# EAGLE design 3UP.v1 (EAGLE 7.3.0)
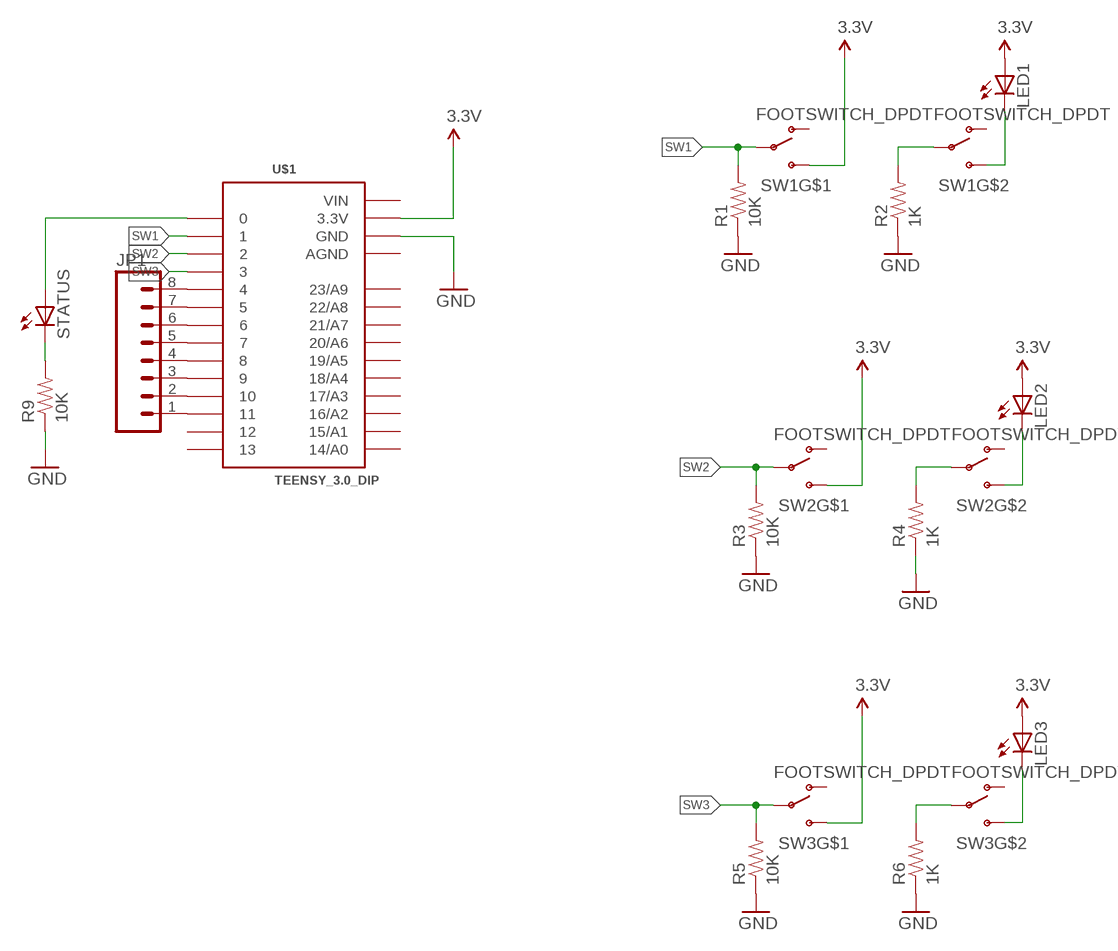
[diagram p0: schematic, sheet 1]

## Parts
JP1  M08NO_SILK  [1X08_NO_SILK]
LED1  LED5MM-W/STENCIL  [LED5MM-STENCILHOLE]
LED2  LED5MM-W/STENCIL  [LED5MM-STENCILHOLE]
LED3  LED5MM-W/STENCIL  [LED5MM-STENCILHOLE]
R1  10K  RESISTOR0805-RES  [0805]
R2  1K  RESISTOR0805-RES  [0805]
R3  10K  RESISTOR0805-RES  [0805]
R4  1K  RESISTOR0805-RES  [0805]
R5  10K  RESISTOR0805-RES  [0805]
R6  1K  RESISTOR0805-RES  [0805]
R9  10K  RESISTOR0805-RES  [0805]
STATUS  LED5MM-W/STENCIL  [LED5MM-STENCILHOLE]
SW1  FOOTSWITCH_DPDT  [FOOTSWITCH]
SW2  FOOTSWITCH_DPDT  [FOOTSWITCH]
SW3  FOOTSWITCH_DPDT  [FOOTSWITCH]
U$1  TEENSY_3.0_DIP  [TEENSY_3.0_DIP]

## Nets
3.3V: LED1.A LED2.A LED3.A SW1.P$3(S) SW2.P$3(S) SW3.P$3(S) U$1.3.3V
GND: R1.1 R2.1 R3.1 R4.1 R5.1 R6.1 R9.1 U$1.GND
N$1: R4.2 SW2.P$5(P)
N$2: R2.2 SW1.P$5(P)
N$3: LED1.K(C) SW1.P$6(S)
N$4: LED2.K(C) SW2.P$6(S)
N$5: R6.2 SW3.P$5(P)
N$6: LED3.K(C) SW3.P$6(S)
N$9: R9.2 STATUS.K(C)
N$10: STATUS.A U$1.0
N$13: JP1.1 U$1.11
N$14: JP1.2 U$1.10
N$15: JP1.3 U$1.9
N$16: JP1.4 U$1.8
N$17: JP1.5 U$1.7
N$18: JP1.6 U$1.6
N$19: JP1.7 U$1.5
N$20: JP1.8 U$1.4
SW1: R1.2 SW1.P$2(P) U$1.1
SW2: R3.2 SW2.P$2(P) U$1.2
SW3: R5.2 SW3.P$2(P) U$1.3
Unconnected: SW1.P$1(O) SW1.P$4(O) SW2.P$1(O) SW2.P$4(O) SW3.P$1(O) SW3.P$4(O) U$1.12 U$1.13 U$1.14/A0 U$1.15/A1 U$1.16/A2 U$1.17/A3 U$1.18/A4 U$1.19/A5 U$1.20/A6 U$1.21/A7 U$1.22/A8 U$1.23/A9

## Power pins joined to a net without a drawn wire
AGND: U$1.AGND
VIN: U$1.VIN

## Library data of the parts
JP1 = SparkFun-Connectors:M08: Header 8 Standard 8-pin 0.1" header. Use with straight break away headers (SKU : PRT-00116), right angle break away headers (PRT-00553), swiss pins (PRT-00743), machine pins (PRT-00117), and female headers (PRT-00115).
LED1-LED3 STATUS = SparkFun-LED:LED: LEDs Standard schematic elements and footprints for 5mm, 3mm, 1206, and 0603 sized LEDs. 5mm - Spark Fun Electronics SKU : COM-00529 (and others)
R1-R6 R9 = SparkFun-Passives:RESISTOR: Resistor Basic schematic elements and footprints for 0603, 1206, and PTH resistors.
SW1-SW3 = barsstronics:FOOTSWITCH_DPDT
U$1 = Teensy3.0:TEENSY_3.0_DIP

## Board
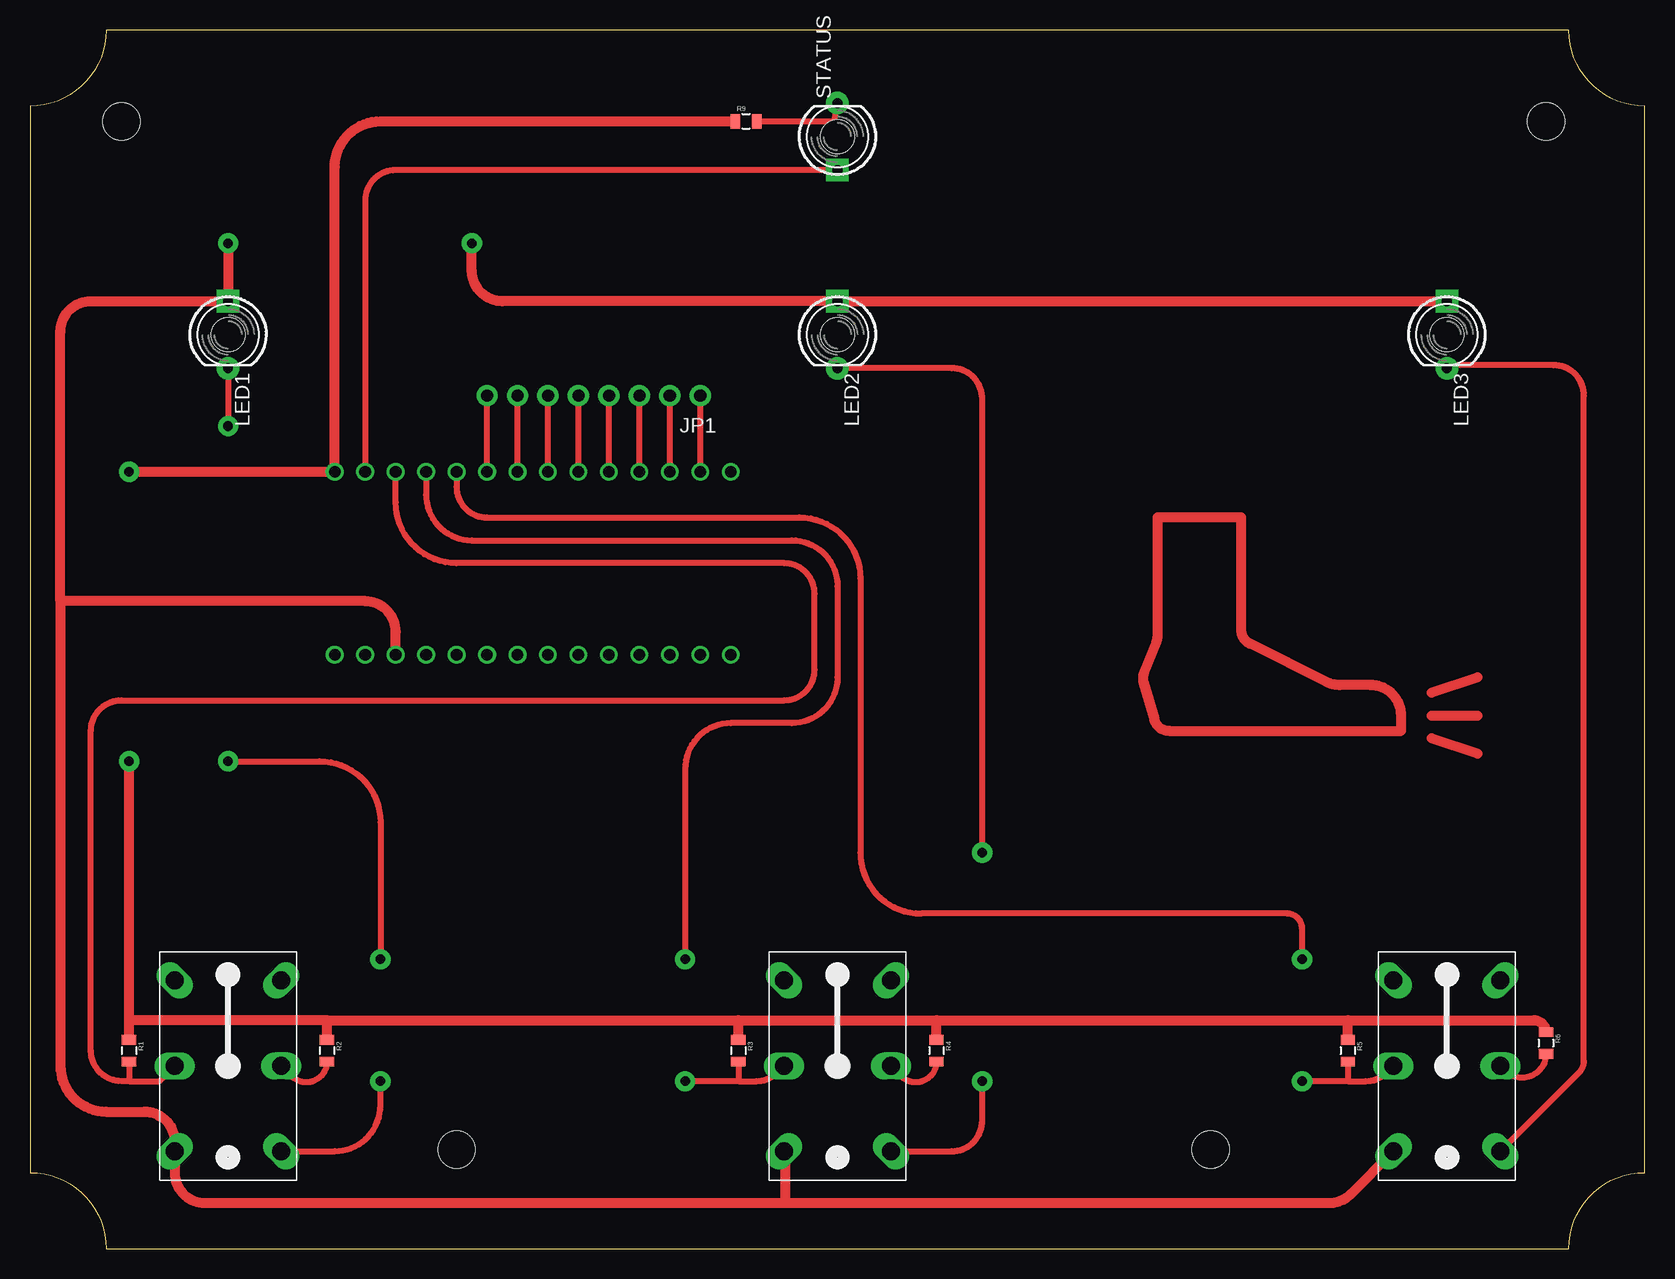
[diagram p1: board, top side]
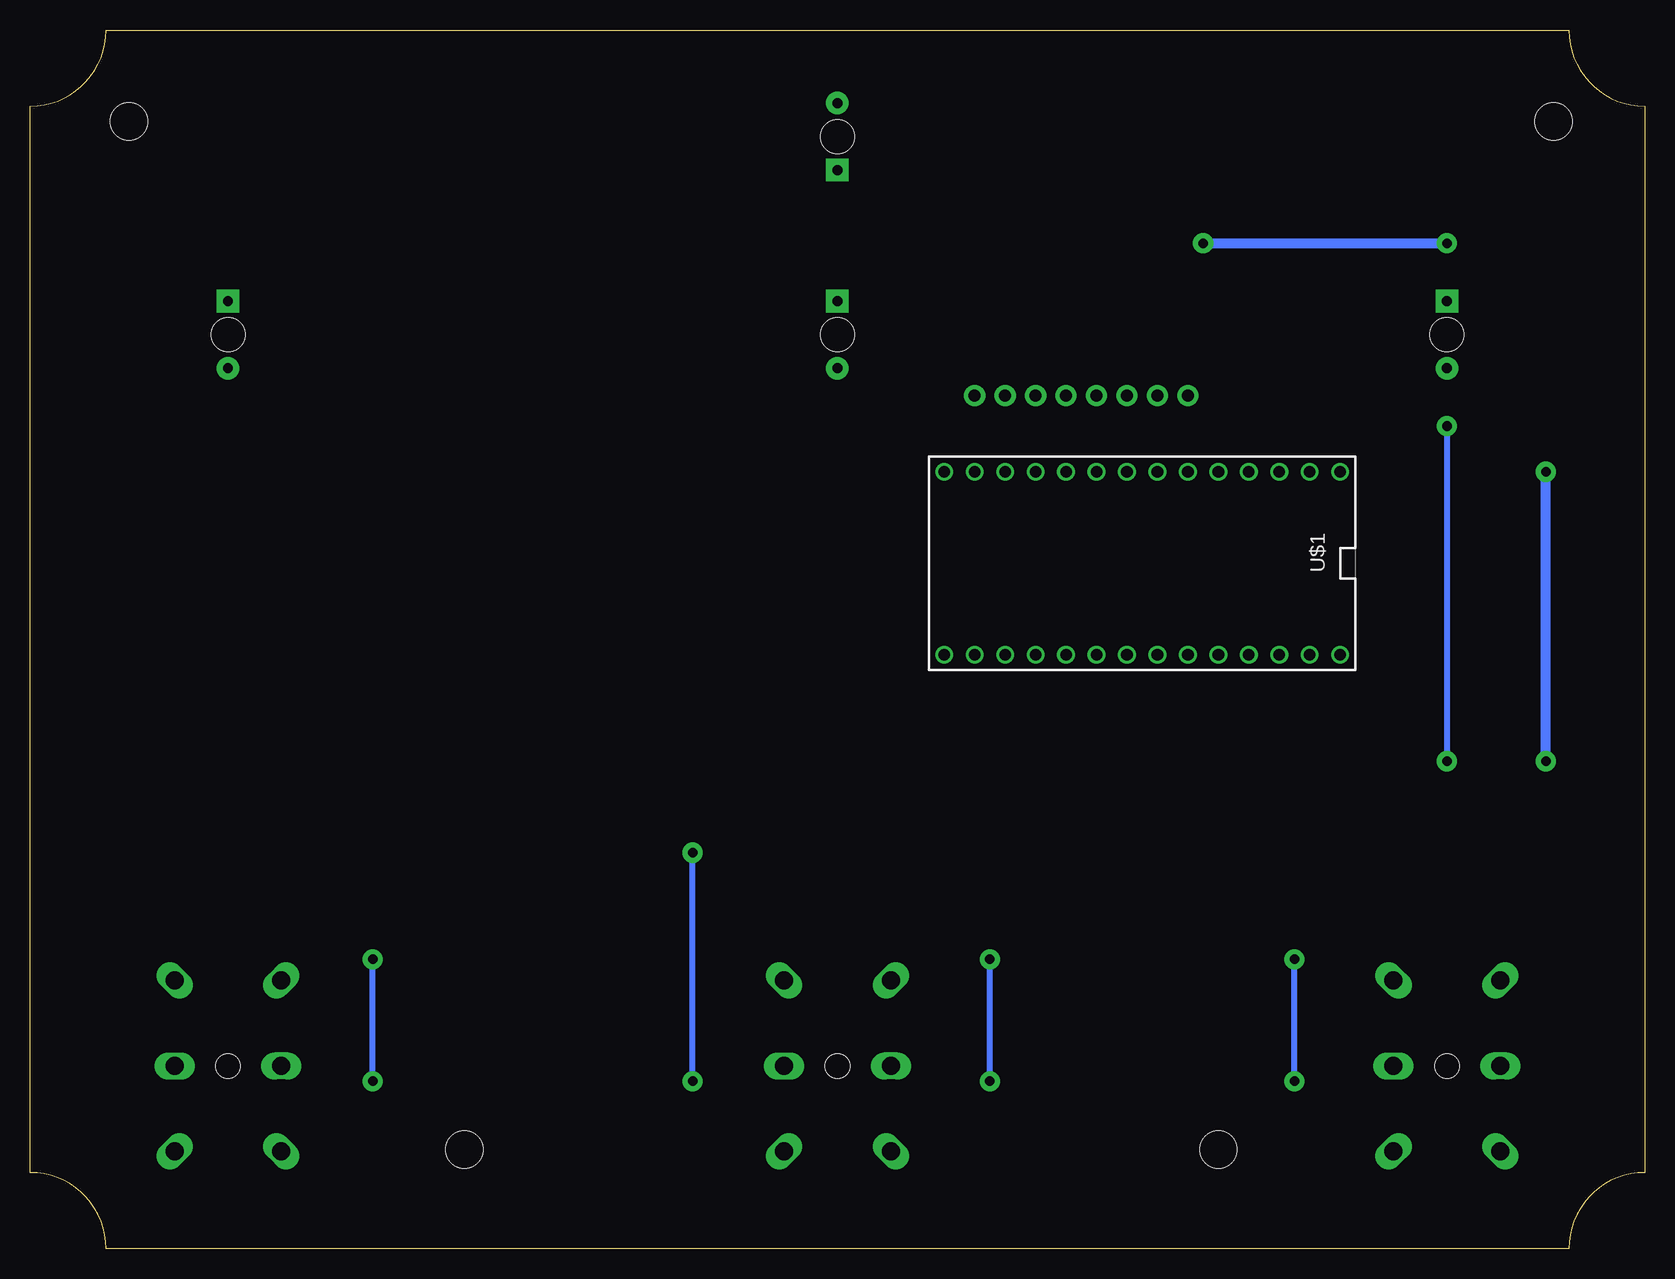
[diagram p2: board, bottom side, seen from below]

Size 134.62 x 101.6 mm. Coordinates in mm from the lower left corner, seen from the top.
Outline: 6.35,0 128.27,0 arc-90 134.62,6.35 134.62,95.25 arc-90 128.27,101.6 6.35,101.6 arc-90 0,95.25 0,6.35 arc-90 6.35,0
Copper layers (1*16): Top 0.035mm / dielectric 1.5mm / Bottom 0.035mm
Design rules "Othermill-DRC-1-32": minimum track width 8mil, minimum drill 0.8mm, track to track 0.794003125mm, track to pad 0.794003125mm, pad to pad 0.794003125mm, via to via 0.794003125mm, smd to smd 0mil, copper to edge 0mil, drill to drill 1mil, minimum pad ring 10mil, minimum via ring 10mil, stop-mask expansion 1mil, vias tented up to drill 30mil, thermal gap 10mil
Holes 2.03 mm at 16.51,15.24 67.31,15.24 118.11,15.24
Holes 3.1 mm at 126.36,93.98 7.62,93.98 98.42,8.26 35.56,8.26

### Footprints (pad centres in the part's own frame; a part is rotated, then mirrored left to right if it is on the bottom)
1X08_NO_SILK = drill 1.016 pad 1.778: 1 0,0; 2 2.54,0; 3 5.08,0; 4 7.62,0; 5 10.16,0; 6 12.7,0; 7 15.24,0; 8 17.78,0
LED5MM-STENCILHOLE = drill 0.813 pad 1.88 square: A -2.794,0 | drill 0.813 pad 1.88: K 2.794,0 | hole 2.8: 0,0
0805 = smd 0.8 x 1.2: 1 -0.9,0; 2 0.9,0
FOOTSWITCH = drill 1.5 long: P$1 -4.445,7.112; P$2 -4.445,0; P$3 -4.445,-7.112; P$4 4.445,7.112; P$5 4.445,0; P$6 4.445,-7.112
TEENSY_3.0_DIP = drill 0.965: 0 -7.62,13.97; 1 -7.62,11.43; 2 -7.62,8.89; 3 -7.62,6.35; 3.3V 7.62,11.43; 4 -7.62,3.81; 5 -7.62,1.27; 6 -7.62,-1.27; 7 -7.62,-3.81; 8 -7.62,-6.35; 9 -7.62,-8.89; 10 -7.62,-11.43; 11 -7.62,-13.97; 12 -7.62,-16.51; 13 7.62,-16.51; 14/A0 7.62,-13.97; 15/A1 7.62,-11.43; 16/A2 7.62,-8.89; 17/A3 7.62,-6.35; 18/A4 7.62,-3.81; 19/A5 7.62,-1.27; 20/A6 7.62,1.27; 21/A7 7.62,3.81; 22/A8 7.62,6.35; 23/A9 7.62,8.89; AGND 7.62,13.97; GND -7.62,16.51; VIN 7.62,16.51

### Placement (x,y rotation side)
JP1  55.88,71.12 180 top
LED1  16.51,76.2 270 top
LED2  67.31,76.2 270 top
LED3  118.11,76.2 270 top
R1  8.26,16.51 270 top
R2  24.77,16.51 270 top
R3  59.05,16.51 270 top
R4  75.56,16.51 270 top
R5  109.86,16.51 270 top
R6  126.36,17.14 270 top
R9  59.69,93.98 0 top
STATUS  67.31,92.71 90 top
SW1  16.51,15.24 0 top
SW2  67.31,15.24 0 top
SW3  118.11,15.24 0 top
U$1  41.91,57.15 270 bottom

### Tracks (layer width: path | path; a pad name or v marks a point on that pad's centre or on a via)
3.3V  (via drill 0.8 pad 1.68)
  Top 0.813: 118.11,78.74 LED3.A LED2.A 39.37,78.99 arc-90 36.83,81.53 v36.83,83.82 | 12.06,7.62 12.06,6.35 arc90 14.61,3.81 62.99,3.81 | 12.06,7.62 11.43,8.26 | 12.06,7.62 SW1.P$3 12.06,8.89 arc90 9.53,11.43 6.35,11.43 arc-90 2.54,15.24 2.54,53.98 | 62.99,3.81 108.3,3.81 arc45 110.09,4.55 SW3.P$3 | 62.74,8.13 SW2.P$3 62.99,8.13 62.99,3.81 | U$1.3.3V 30.48,51.44 arc90 27.94,53.98 2.54,53.98 | 2.54,53.98 2.54,76.45 arc-90 5.08,78.99 LED1.A v16.51,83.82
  Bottom 0.813: v36.83,83.82 v16.51,83.82
GND  (via drill 0.8 pad 1.68)
  Top 0.813: R1.1 8.26,19.05 | 24.77,19.05 59.05,19.05 | 59.05,19.05 75.56,19.05 | 75.56,19.05 109.86,19.05 | 109.86,19.05 125.36,19.05 arc-90 R6.1 | R5.1 109.86,19.05 | R4.1 75.56,19.05 | R3.1 59.05,19.05 | R2.1 24.77,19.05 | 24.77,19.05 8.26,19.05 | 8.26,19.05 v8.26,40.64 | v8.26,64.77 U$1.GND 25.4,90.17 arc-90 29.21,93.98 R9.1
  Bottom 0.813: v8.26,40.64 v8.26,64.77
N$1
  Top 0.508: R4.2 arc-135 72.61,14.39 SW2.P$5
N$2
  Top 0.508: R2.2 arc-135 21.81,14.39 SW1.P$5
N$3  (via drill 0.8 pad 1.68)
  Top 0.508: SW1.P$6 25.4,8.13 arc90 29.21,11.94 v29.21,13.97 | v16.51,40.64 24.13,40.64 arc-90 29.21,35.56 v29.21,24.13 | LED1.K v16.51,68.58
  Bottom 0.508: v29.21,13.97 v29.21,24.13 | v16.51,68.58 v16.51,40.64
N$4  (via drill 0.8 pad 1.68)
  Top 0.508: SW2.P$6 76.83,8.13 arc90 79.38,10.67 v79.38,13.97 | v79.38,33.02 79.38,70.87 arc90 76.83,73.41 LED2.K
  Bottom 0.508: v79.38,13.97 v79.38,33.02
N$5
  Top 0.508: R6.2 arc-135 122.96,14.84 SW3.P$5
N$6
  Top 0.508: LED3.K 118.11,73.66 127,73.66 arc-90 129.54,71.12 129.54,15.64 arc-45 129.17,14.74 SW3.P$6
N$7
  Top 0.813: 93.98,60.96 93.98,51.05 arc-22 93.89,50.57 92.87,48.03 arc38 92.83,47.21 93.72,44.1 arc74 94.94,43.18 114.3,43.18 114.3,44.45 arc90 111.76,46.99 109.19,46.99 arc-27 108.05,47.26 101.67,50.45 arc-63 100.97,51.59 100.97,60.96 93.98,60.96
N$8
  Top 0.813: 116.84,46.35 120.65,47.62
N$9
  Top 0.508: R9.2 67.06,93.98 STATUS.K
N$10
  Top 0.508: STATUS.A 30.48,89.92 arc90 27.94,87.38 U$1.0
N$11
  Top 0.813: 116.84,44.45 120.65,44.45
N$12
  Top 0.813: 116.84,42.55 120.65,41.27
N$13
  Top 0.508: U$1.11 JP1.1
N$14
  Top 0.508: U$1.10 JP1.2
N$15
  Top 0.508: U$1.9 JP1.3
N$16
  Top 0.508: U$1.8 JP1.4
N$17
  Top 0.508: U$1.7 JP1.5
N$18
  Top 0.508: U$1.6 JP1.6
N$19
  Top 0.508: U$1.5 JP1.7
N$20
  Top 0.508: U$1.4 JP1.8
SW1
  Top 0.508: R1.2 8.26,13.97 | 8.26,13.97 10.79,13.97 SW1.P$2 | 8.26,13.97 7.62,13.97 arc-90 5.08,16.51 5.08,43.18 arc-90 7.62,45.72 62.87,45.72 arc90 65.41,48.26 65.41,54.61 arc90 62.87,57.15 35.56,57.15 arc-90 30.48,62.23 U$1.1
SW2  (via drill 0.8 pad 1.68)
  Top 0.508: 59.05,13.97 60.54,13.97 arc45 62.34,14.71 SW2.P$2 | R3.2 59.05,13.97 | 59.05,13.97 v54.61,13.97 | v54.61,24.13 54.61,40.01 arc-90 58.42,43.81 63.5,43.81 arc90 67.31,47.62 67.31,55.24 arc90 63.5,59.05 36.83,59.05 arc-90 33.02,62.87 U$1.2
  Bottom 0.508: v54.61,13.97 v54.61,24.13
SW3  (via drill 0.8 pad 1.68)
  Top 0.508: 109.86,13.97 111.34,13.97 arc45 113.14,14.71 SW3.P$2 | R5.2 109.86,13.97 | 109.86,13.97 v106.05,13.97 | U$1.3 35.56,63.5 arc90 38.1,60.96 64.14,60.96 arc-90 69.22,55.88 69.22,33.02 arc90 74.3,27.94 104.78,27.94 arc-90 106.05,26.67 v106.05,24.13
  Bottom 0.508: v106.05,13.97 v106.05,24.13